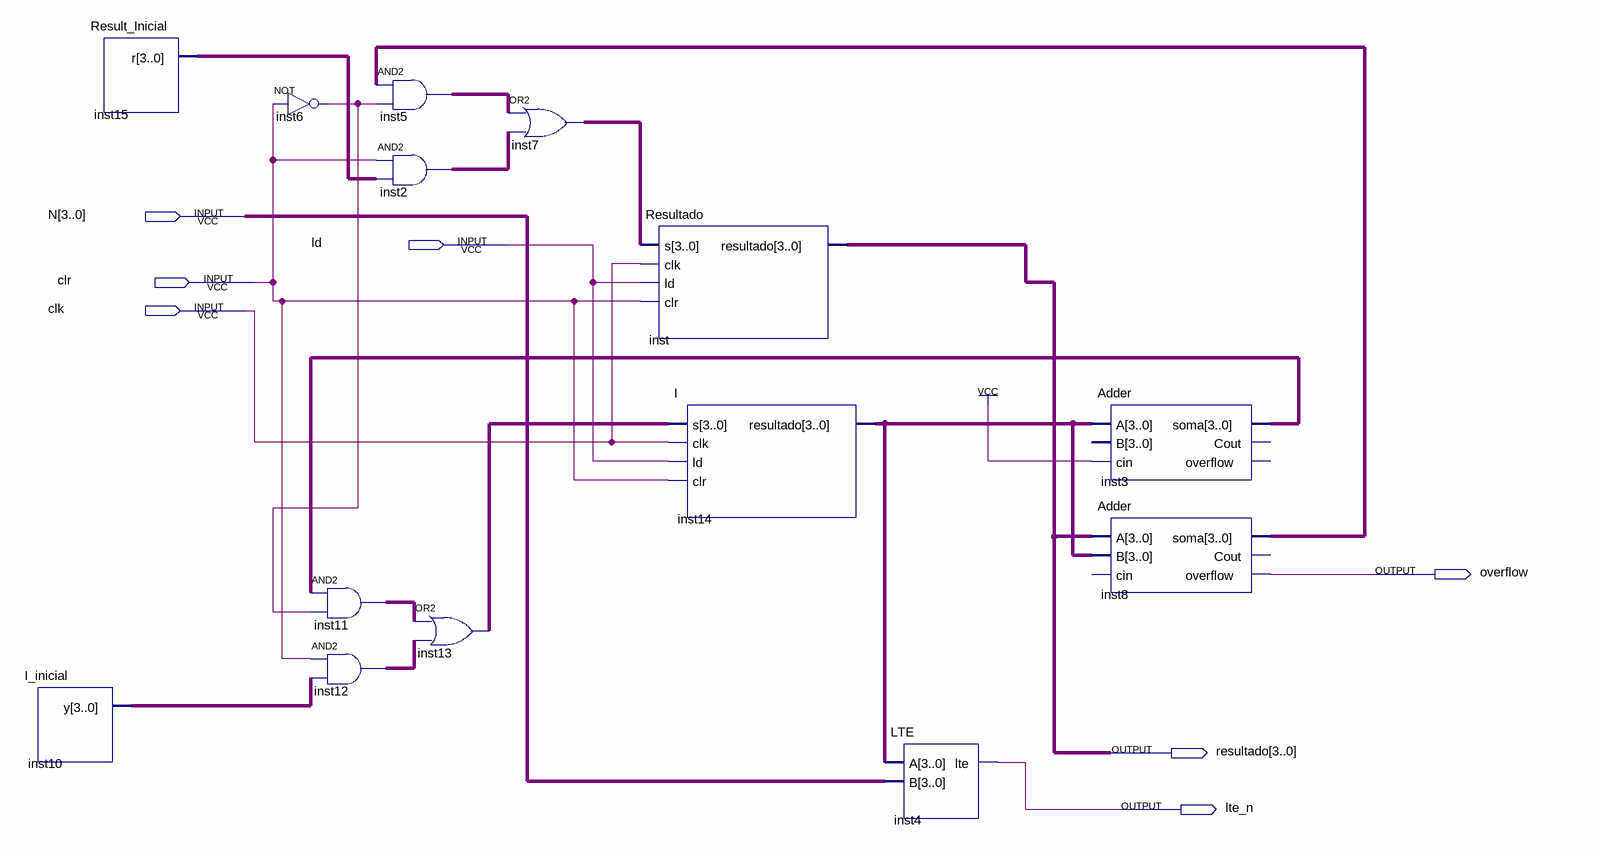
[diagram p0: schematic sheet]
// Quartus schematic Operacional.bdf as structural Verilog: 14 symbols, 7 pins
module Operacional (
  input  [3:0] N,
  input  ld,
  input  clr,
  input  clk,
  output overflow,
  output [3:0] resultado,
  output lte_n
);

  wire inst6_out;
  wire [3:0] inst2_out, inst3_soma, inst5_out, inst7_out, inst8_soma, inst10_y, inst11_out, inst12_out,
       inst13_out, inst14_resultado, inst15_r;

  I_inicial inst10 (.y(inst10_y));
  Result_Inicial inst15 (.r(inst15_r));
  not inst6 (inst6_out, clr);
  assign inst5_out = inst8_soma & {4{inst6_out}};  // AND2 inst5, 4 bits wide
  assign inst2_out = {4{clr}} & inst15_r;  // AND2 inst2, 4 bits wide
  assign inst11_out = inst3_soma & {4{inst6_out}};  // AND2 inst11, 4 bits wide
  assign inst12_out = {4{clr}} & inst10_y;  // AND2 inst12, 4 bits wide
  assign inst13_out = inst11_out | inst12_out;  // OR2 inst13, 4 bits wide
  assign inst7_out = inst5_out | inst2_out;  // OR2 inst7, 4 bits wide
  Resultado inst (.s(inst7_out), .clk(clk), .ld(ld), .clr(clr), .resultado(resultado));
  I inst14 (.s(inst13_out), .clk(clk), .ld(ld), .clr(clr), .resultado(inst14_resultado));
  LTE inst4 (.A(inst14_resultado), .B(N), .lte(lte_n));
  Adder inst3 (.A(inst14_resultado), .cin(1'b1), .soma(inst3_soma));  // open: B, Cout, overflow
  Adder inst8 (.A(resultado), .B(inst14_resultado), .soma(inst8_soma), .overflow(overflow));  // open: cin, Cout
endmodule
